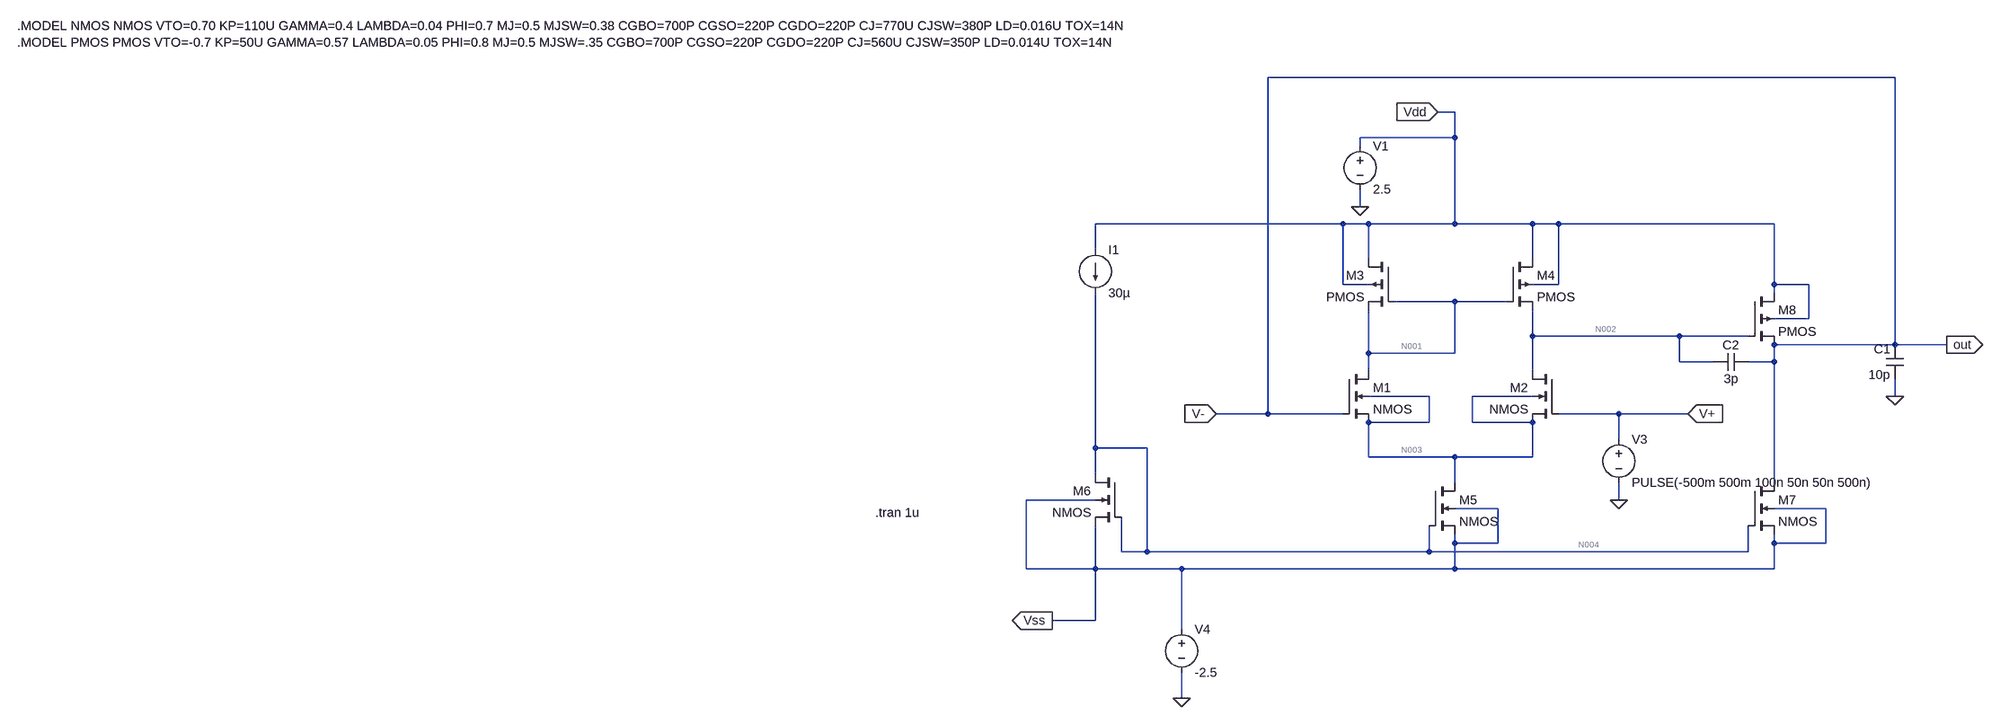
[diagram p0: schematic Draft5.asc]
Draft5.asc, the LTspice schematic file:
Version 4
SHEET 1 1848 680
WIRE 800 -528 -368 -528
WIRE -16 -464 -48 -464
WIRE -16 -416 -16 -464
WIRE -16 -416 -192 -416
WIRE -192 -400 -192 -416
WIRE -192 -288 -192 -320
WIRE -224 -256 -688 -256
WIRE -176 -256 -224 -256
WIRE -16 -256 -16 -416
WIRE -16 -256 -176 -256
WIRE 128 -256 -16 -256
WIRE 176 -256 128 -256
WIRE 576 -256 176 -256
WIRE -688 -208 -688 -256
WIRE -176 -192 -176 -256
WIRE 128 -192 128 -256
WIRE -224 -144 -224 -256
WIRE -176 -144 -224 -144
WIRE 176 -144 176 -256
WIRE 176 -144 128 -144
WIRE 576 -144 576 -256
WIRE 640 -144 576 -144
WIRE 576 -128 576 -144
WIRE -16 -112 -128 -112
WIRE 80 -112 -16 -112
WIRE 640 -80 640 -144
WIRE 640 -80 576 -80
WIRE 128 -48 128 -96
WIRE 400 -48 128 -48
WIRE 528 -48 400 -48
WIRE 800 -32 800 -528
WIRE 800 -32 576 -32
WIRE 896 -32 800 -32
WIRE -176 -16 -176 -96
WIRE -16 -16 -16 -112
WIRE -16 -16 -176 -16
WIRE 400 0 400 -48
WIRE 464 0 400 0
WIRE 576 0 576 -32
WIRE 576 0 528 0
WIRE -176 16 -176 -16
WIRE 128 16 128 -48
WIRE -64 64 -176 64
WIRE 128 64 16 64
WIRE 800 64 800 32
WIRE -368 96 -368 -528
WIRE -368 96 -464 96
WIRE -224 96 -368 96
WIRE 288 96 176 96
WIRE 416 96 288 96
WIRE -64 112 -64 64
WIRE -64 112 -176 112
WIRE 16 112 16 64
WIRE 128 112 16 112
WIRE 288 144 288 96
WIRE -688 160 -688 -128
WIRE -592 160 -688 160
WIRE -176 176 -176 112
WIRE -16 176 -176 176
WIRE 128 176 128 112
WIRE 128 176 -16 176
WIRE -688 208 -688 160
WIRE -16 224 -16 176
WIRE 576 224 576 0
WIRE -688 256 -816 256
WIRE 288 256 288 224
WIRE 64 272 -16 272
WIRE 672 272 576 272
WIRE -16 336 -16 320
WIRE 64 336 64 272
WIRE 64 336 -16 336
WIRE 576 336 576 320
WIRE 672 336 672 272
WIRE 672 336 576 336
WIRE -640 352 -640 288
WIRE -592 352 -592 160
WIRE -592 352 -640 352
WIRE -64 352 -64 304
WIRE -64 352 -592 352
WIRE 528 352 528 304
WIRE 528 352 -64 352
WIRE -816 384 -816 256
WIRE -688 384 -688 304
WIRE -688 384 -816 384
WIRE -528 384 -688 384
WIRE -16 384 -16 336
WIRE -16 384 -528 384
WIRE 576 384 576 336
WIRE 576 384 -16 384
WIRE -688 480 -688 384
WIRE -688 480 -768 480
WIRE -528 496 -528 384
WIRE -528 624 -528 576
FLAG 800 64 0
FLAG 896 -32 out
IOPIN 896 -32 Out
FLAG -48 -464 Vdd
IOPIN -48 -464 In
FLAG -464 96 V-
IOPIN -464 96 In
FLAG 416 96 V+
IOPIN 416 96 In
FLAG -768 480 Vss
IOPIN -768 480 Out
FLAG -192 -288 0
FLAG 288 256 0
FLAG -528 624 0
DATAFLAG 832 -32 ""
SYMBOL nmos4 -224 16 R0
SYMATTR InstName M1
SYMATTR Value2 l=1u w=3u
SYMBOL nmos4 176 16 M0
SYMATTR InstName M2
SYMATTR Value2 l=1u w=3u
SYMBOL pmos4 -128 -192 M0
SYMATTR InstName M3
SYMATTR Value2 l=1u w=11u
SYMBOL pmos4 80 -192 R0
SYMATTR InstName M4
SYMATTR Value2 l=1u w=11u
SYMBOL nmos4 -64 224 R0
SYMATTR InstName M5
SYMATTR Value2 l=1u w=1u
SYMBOL cap 816 32 R180
WINDOW 0 24 56 Left 2
WINDOW 3 24 8 Left 2
SYMATTR InstName C1
SYMATTR Value 10p
SYMBOL current -688 -208 R0
WINDOW 123 0 0 Left 0
WINDOW 39 0 0 Left 0
SYMATTR InstName I1
SYMATTR Value 30µ
SYMBOL nmos4 -640 208 M0
SYMATTR InstName M6
SYMATTR Value2 l=1u w=2u
SYMBOL nmos4 528 224 R0
SYMATTR InstName M7
SYMATTR Value2 l=1u w=8u
SYMBOL pmos4 528 -128 R0
SYMATTR InstName M8
SYMATTR Value2 l=1u w=86u
SYMBOL cap 528 -16 R90
WINDOW 0 0 32 VBottom 2
WINDOW 3 32 32 VTop 2
SYMATTR InstName C2
SYMATTR Value 3p
SYMBOL voltage -192 -416 R0
WINDOW 123 0 0 Left 0
WINDOW 39 0 0 Left 0
SYMATTR InstName V1
SYMATTR Value 2.5
SYMBOL voltage 288 128 R0
WINDOW 123 0 0 Left 0
WINDOW 39 0 0 Left 0
SYMATTR InstName V3
SYMATTR Value PULSE(-500m 500m 100n 50n 50n 500n)
SYMBOL voltage -528 480 R0
WINDOW 123 0 0 Left 0
WINDOW 39 0 0 Left 0
SYMATTR InstName V4
SYMATTR Value -2.5
TEXT -1096 280 Left 2 !.tran 1u
TEXT -2688 -624 Left 2 !.MODEL NMOS NMOS VTO=0.70 KP=110U GAMMA=0.4 LAMBDA=0.04 PHI=0.7 MJ=0.5 MJSW=0.38 CGBO=700P CGSO=220P CGDO=220P CJ=770U CJSW=380P LD=0.016U TOX=14N\n.MODEL PMOS PMOS VTO=-0.7 KP=50U GAMMA=0.57 LAMBDA=0.05 PHI=0.8 MJ=0.5 MJSW=.35 CGBO=700P CGSO=220P CGDO=220P CJ=560U CJSW=350P LD=0.014U TOX=14N

The netlist it stands for:
* Draft5.asc
M1 N001 V- N003 N003 NMOS l=1u w=3u
M2 N002 V+ N003 N003 NMOS l=1u w=3u
M3 Vdd N001 N001 Vdd PMOS l=1u w=11u
M4 Vdd N001 N002 Vdd PMOS l=1u w=11u
M5 N003 N004 Vss Vss NMOS l=1u w=1u
C1 0 V- 10p
I1 Vdd N004 30µ
M6 N004 N004 Vss Vss NMOS l=1u w=2u
M7 V- N004 Vss Vss NMOS l=1u w=8u
M8 Vdd N002 V- Vdd PMOS l=1u w=86u
C2 V- N002 3p
V1 Vdd 0 2.5
V3 V+ 0 PULSE(-500m 500m 100n 50n 50n 500n)
V4 Vss 0 -2.5
.model NMOS NMOS
.model PMOS PMOS
.lib standard.mos
.tran 1u
.MODEL NMOS NMOS VTO=0.70 KP=110U GAMMA=0.4 LAMBDA=0.04 PHI=0.7 MJ=0.5 MJSW=0.38 CGBO=700P CGSO=220P CGDO=220P CJ=770U CJSW=380P LD=0.016U TOX=14N
.MODEL PMOS PMOS VTO=-0.7 KP=50U GAMMA=0.57 LAMBDA=0.05 PHI=0.8 MJ=0.5 MJSW=.35 CGBO=700P CGSO=220P CGDO=220P CJ=560U CJSW=350P LD=0.014U TOX=14N
.backanno
.end

* Results of the author's LTspice run, read from the files saved beside the schematic
* Operating Point, zero values left out:
*   V(n001) = 1.641 V
*   V(v-) = -500.5 mV
*   V(n003) = -1.398 V
*   V(n002) = 1.58 V
*   V(v+) = -500 mV
*   V(vdd) = 2.5 V
*   V(n004) = -1.298 V
*   V(vss) = -2.5 V
*   Id(M1) = 7.46 µA
*   Ib(M1) = -3.049 pA
*   Is(M1) = -7.46 µA
*   Id(M2) = 7.482 µA
*   Ib(M2) = -2.988 pA
*   Is(M2) = -7.482 µA
*   Id(M5) = 14.94 µA
*   Ib(M5) = -1.112 pA
*   Is(M5) = -14.94 µA
*   Id(M6) = 30 µA
*   Ib(M6) = -1.212 pA
*   Is(M6) = -30 µA
*   Id(M7) = 123.7 µA
*   Ib(M7) = -2.009 pA
*   Is(M7) = -123.7 µA
*   Id(M3) = 7.46 µA
*   Is(M3) = -7.46 µA
*   Id(M4) = 7.482 µA
*   Is(M4) = -7.482 µA
*   Id(M8) = 123.7 µA
*   Ib(M8) = 3.011 pA
*   Is(M8) = -123.7 µA
*   I(I1) = 30 µA
*   I(V1) = -168.6 µA
*   I(V4) = 168.6 µA
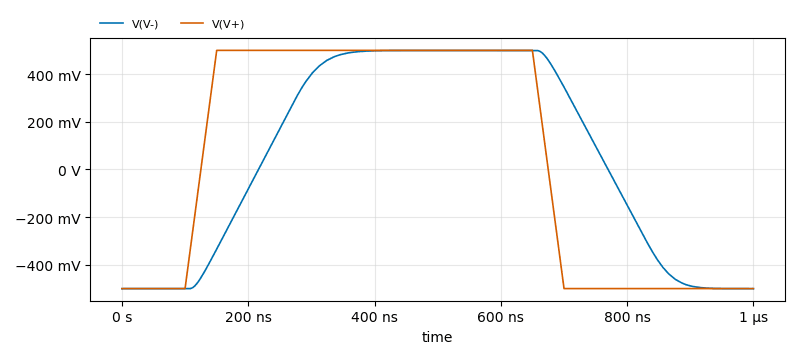
[diagram p1: Transient Analysis of Draft5.asc, plotted from the saved traces]
* Transient Analysis, 1 run:
*   V(V-): min -500.9 mV, max 499.9 mV, average 52.56 mV, rms 424.5 mV, last -500.5 mV
*   V(V+): min -500 mV, max 500 mV, average 50 mV, rms 483.2 mV, last -500 mV